# EAGLE design small_weather_station (EAGLE 6.5.0)
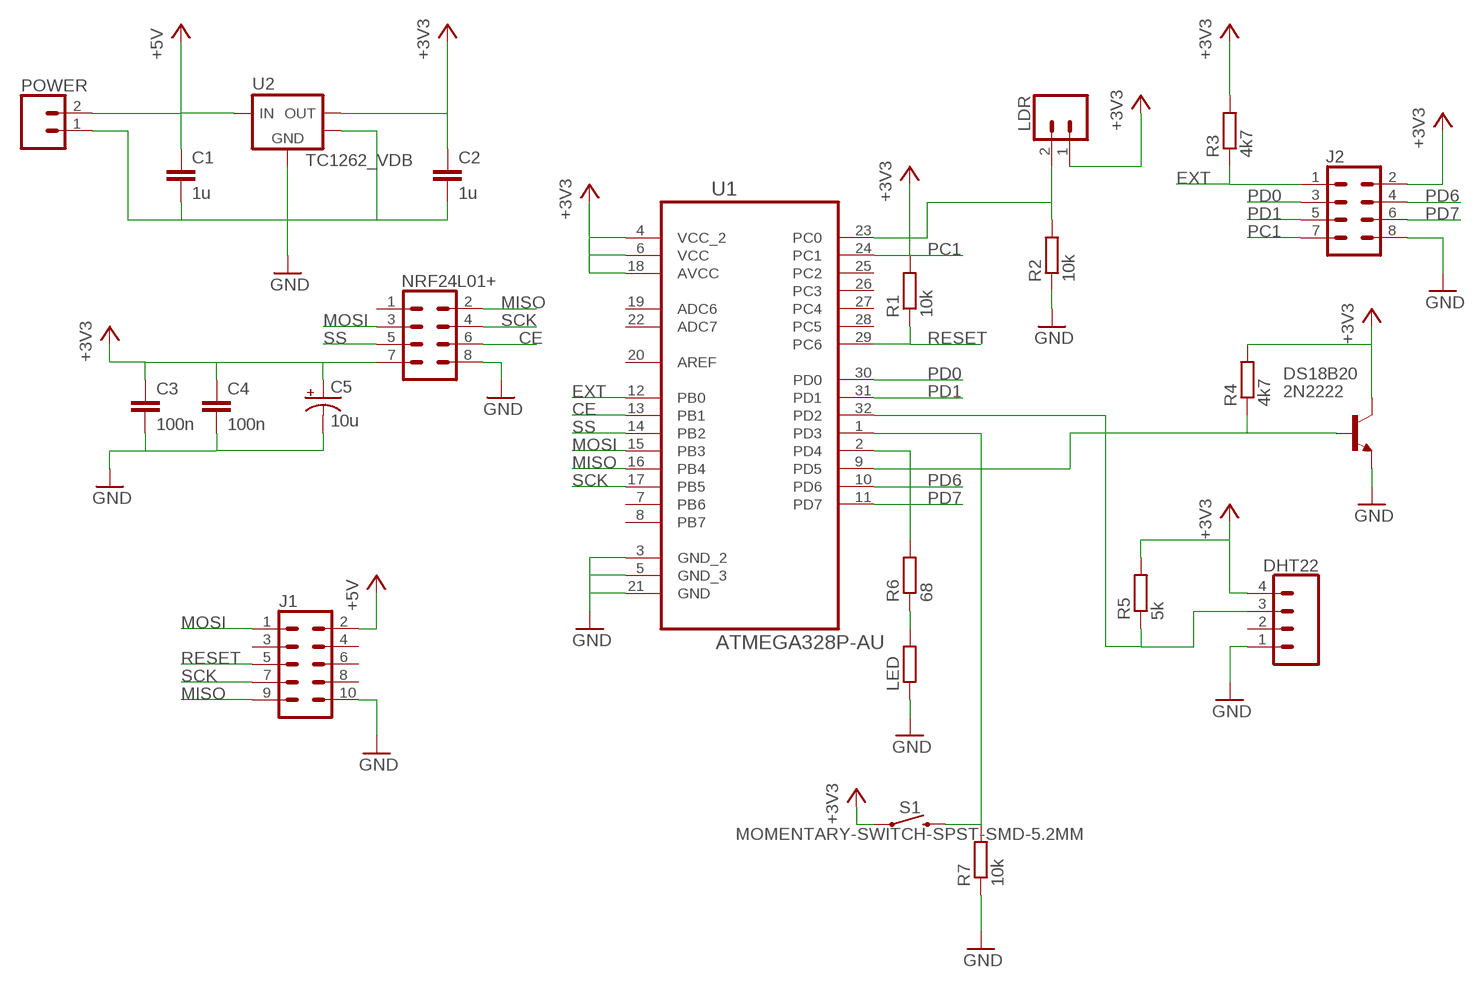
[diagram p0: schematic, sheet 1]

## Parts
C1  1u  C-EUC0402  [C0402]
C2  1u  C-EUC0402  [C0402]
C3  100n  C-EUC0402  [C0402]
C4  100n  C-EUC0402  [C0402]
C5  10u  CPOL-USD  [PANASONIC_D]
DHT22  CONN_04  [1X04]
DS18B20  2N2222  [TO92-EBC-OVAL]
J1  CONN_05X2SHD-NS  [2X5-SHROUDED-NS]
J2  CONN_04X2  [2X4]
LDR  CONN_02  [1X02]
LED  R-EU_R0402  [R0402]
NRF24L01+  CONN_04X2  [2X4]
POWER  CONN_02  [1X02]
R1  10k  R-EU_R0402  [R0402]
R2  10k  R-EU_R0402  [R0402]
R3  4k7  R-EU_R0402  [R0402]
R4  4k7  R-EU_R0402  [R0402]
R5  5k  R-EU_R0402  [R0402]
R6  68  R-EU_R0402  [R0402]
R7  10k  R-EU_R0402  [R0402]
S1  MOMENTARY-SWITCH-SPST-SMD-5.2MM  [TACTILE_SWITCH_SMD_5.2MM]
U1  ATMEGA328P-AU  [QFP80P900X900X120-32N]
U2  TC1262_VDB  [SOT-223-3]

## Nets
+3V3: C2.1 C3.1 C4.1 C5.+ DHT22.4 DS18B20.C J2.2 LDR.1 NRF24L01+.7 R1.2 R3.2 R4.2 R5.2 S1.1 U1.4(VCC_2) U1.6(VCC) U1.18(AVCC) U2.3(VOUT)
+5V: C1.1 J1.2 POWER.2 U2.1(VIN)
CE: NRF24L01+.6 U1.13(PB1)
EXT: J2.1 R3.1 U1.12(PB0)
GND: C1.2 C2.2 C3.2 C4.2 C5.- DHT22.1 DS18B20.E J1.10 J2.8 LED.1 NRF24L01+.8 POWER.1 R2.1 R7.1 U1.3(GND_2) U1.5(GND_3) U1.21(GND) U2.2(GND) U2.4(TAB)
MISO: J1.9 NRF24L01+.2 U1.16(PB4)
MOSI: J1.1 NRF24L01+.3 U1.15(PB3)
N$1: R6.2 U1.2(PD4)
N$6: DHT22.3 R5.1 U1.32(PD2)
N$10: LDR.2 R2.2 U1.23(PC0)
N$12: DS18B20.B R4.1 U1.9(PD5)
N$13: LED.2 R6.1
N$16: R7.2 S1.3 U1.1(PD3)
PC1: J2.7 U1.24(PC1)
PD0: J2.3 U1.30(PD0)
PD1: J2.5 U1.31(PD1)
PD6: J2.4 U1.10(PD6)
PD7: J2.6 U1.11(PD7)
RESET: J1.5 R1.1 U1.29(PC6)
SCK: J1.7 NRF24L01+.4 U1.17(PB5)
SS: NRF24L01+.5 U1.14(PB2)
Unconnected: DHT22.2 J1.3 J1.4 J1.6 J1.8 NRF24L01+.1 U1.7(PB6) U1.8(PB7) U1.19(ADC6) U1.20(AREF) U1.22(ADC7) U1.25(PC2) U1.26(PC3) U1.27(PC4) U1.28(PC5)

## Library data of the parts
C1-C4 = resistor:C-EU: CAPACITOR, European symbol
C5 = adafruit:CPOL-US: POLARIZED CAPACITOR, American symbol
DHT22 = SparkFun-Connectors:CONN_04: Multi connection point. Often used as Generic Header-pin footprint for 0.1 inch spaced/style header connections On any of the 0.1 inch spaced packages, you can populate with these: Break Away Headers - Straight <https://www.sparkfun.com/products/116> (PRT-00116) Break Away Male Headers - Right Angle <https://www.sparkfun.com/products/553> (PRT-00553) Female Headers <https://www.sparkfun.com/products/115> (PRT-00115) Break Away Headers - Machine Pin <https://www.sparkfun.com/products/117> (PRT-00117) Break Away Female Headers - Swiss Machine Pin <https://www.sparkfun.com/products/743> (PRT-00743) For SCREWTERMINALS and SPRING TERMINALS visit here: Screw Terimnals on SparkFun.com <https://www.sparkfun.com/search/results?term=Screw+Terminals> (5mm/3.5mm/2.54mm spacing) This device is also useful as a general connection point to wire up your design to another part of your project. Our various solder wires solder well into these plated through hole pads. Hook-Up Wire - Assortment (Stranded, 22 AWG) <https://www.sparkfun.com/products/11375> (PRT-11375) Hook-Up Wire - Assortment (Solid Core, 22 AWG) <https://www.sparkfun.com/products/11367> (PRT-11367) View the entire wire category on our website here <https://www.sparkfun.com/categories/141> Special notes: Molex polarized connector foot print use with SKU : PRT-08231 with associated crimp pins and housings. 1MM SMD Version SKU: PRT-10208; PROD_ID: CONN-09696
DS18B20 = adafruit:2N2222: NPN TRANSISTOR Big oval pads
J1 = SparkFun-Connectors:CONN_05X2: Multi connection point. Often used as Generic Header-pin footprint for 0.1 inch spaced/style header connections For AVR SPI programming port, see special device with nice symbol: "AVR_SPI_PROG_5x2.dev" You can populate with any combo of single row headers, but if you'd like an exact match, check these: 2x5 AVR ICSP Male Header <https://www.sparkfun.com/products/778> (PRT-00778) 2x5 Pin Shrouded Header <https://www.sparkfun.com/products/8506> (PRT-08506) On any of the 0.1 inch spaced packages, you can populate with these: Break Away Headers - Straight <https://www.sparkfun.com/products/116> (PRT-00116) Break Away Male Headers - Right Angle <https://www.sparkfun.com/products/553> (PRT-00553) Female Headers <https://www.sparkfun.com/products/115> (PRT-00115) Break Away Headers - Machine Pin <https://www.sparkfun.com/products/117> (PRT-00117) Break Away Female Headers - Swiss Machine Pin <https://www.sparkfun.com/products/743> (PRT-00743) Special note: the shrouded connector mates well with our 5x2 ribbon cables: 2x5 Pin IDC Ribbon Cable <https://www.sparkfun.com/products/8535> (PRT-08535); PROD_ID: CONN-08671; SF_ID: PRT-08506
J2 NRF24L01+ = SparkFun-Connectors:CONN_04X2: Multi connection point. Often used as Generic Header-pin footprint for 0.1 inch spaced/style header connections On any of the 0.1 inch spaced packages, you can populate with these: Break Away Headers - Straight <https://www.sparkfun.com/products/116> (PRT-00116) Break Away Male Headers - Right Angle <https://www.sparkfun.com/products/553> (PRT-00553) Female Headers <https://www.sparkfun.com/products/115> (PRT-00115) Break Away Headers - Machine Pin <https://www.sparkfun.com/products/117> (PRT-00117) Break Away Female Headers - Swiss Machine Pin <https://www.sparkfun.com/products/743> (PRT-00743)
LDR POWER = SparkFun-Connectors:CONN_02: Multi connection point. Often used as Generic Header-pin footprint for 0.1 inch spaced/style header connections On any of the 0.1 inch spaced packages, you can populate with these: Break Away Headers - Straight <https://www.sparkfun.com/products/116> (PRT-00116) Break Away Male Headers - Right Angle <https://www.sparkfun.com/products/553> (PRT-00553) Female Headers <https://www.sparkfun.com/products/115> (PRT-00115) Break Away Headers - Machine Pin <https://www.sparkfun.com/products/117> (PRT-00117) Break Away Female Headers - Swiss Machine Pin <https://www.sparkfun.com/products/743> (PRT-00743) For SCREWTERMINALS and SPRING TERMINALS visit here: Screw Terimnals on SparkFun.com <https://www.sparkfun.com/search/results?term=Screw+Terminals> (5mm/3.5mm/2.54mm spacing) This device is also useful as a general connection point to wire up your design to another part of your project. Our various solder wires solder well into these plated through hole pads. Hook-Up Wire - Assortment (Stranded, 22 AWG) <https://www.sparkfun.com/products/11375> (PRT-11375) Hook-Up Wire - Assortment (Solid Core, 22 AWG) <https://www.sparkfun.com/products/11367> (PRT-11367) View the entire wire category on our website here <https://www.sparkfun.com/categories/141> Special notes: Molex polarized connector foot print use with: PRT-08233 with associated crimp pins and housings. 2.54_SCREWTERM for use with PRT-10571. 3.5mm Screw Terminal footprints for PRT-08084 5mm Screw Terminal footprints for use with PRT-08432
LED R1-R7 = resistor:R-EU_: RESISTOR, European symbol
S1 = SparkFun-Switches:MOMENTARY-SWITCH-SPST: Momentary Switch (Pushbutton) - SPST Normally-open (NO) SPST momentary switches (buttons, pushbuttons). Variants PTH-12MM - 12mm square, through-hole Momentary Pushbutton Switch - 12mm Square <https://www.sparkfun.com/products/9190> (COM-09190) PTH-6.0MM, PTH-6.0MM-KIT - 6.0mm square, through-hole Mini Pushbutton Switch <https://www.sparkfun.com/products/97> (COM-00097) KIT package intended for soldering kit's - only one side of pads' copper is exposed. PTH-RIGHT-ANGLE-KIT - Right-angle, through-hole Right Angle Tactile Button <https://www.sparkfun.com/products/10791> - Used on SparkFun BigTime Watch Kit <https://www.sparkfun.com/products/11734> SMD-12MM - 12mm square, surface-mount Tactile Button - SMD (12mm) <https://www.sparkfun.com/products/12993> (COM-12993) Used on SparkFun PicoBoard <https://www.sparkfun.com/products/11888> SMD-4.5MM - 4.5mm Square Trackball Switch Used on SparkFun Blackberry Trackballer Breakout <https://www.sparkfun.com/products/13169> SMD-4.6MMX2.8MM - 4.60mm x 2.80mm, surface mount Used on SparkFun SAMD21 Mini Breakout <https://www.sparkfun.com/products/13664> SMD-5.2MM, SMD-5.2-REDUNDANT - 5.2mm square, surface-mount Mini Pushbutton Switch - SMD <https://www.sparkfun.com/products/8720> (COM-08720) Used on Arduino Pro Mini <https://www.sparkfun.com/products/11114> REDUNDANT package connects both switch circuits together SMD-6.0X3.5MM - 6.0 x 3.5mm, surface mount Momentary Reset Switch SMD <https://www.sparkfun.com/products/8229> (COM-08229) SMD-6.2MM-TALL - 6.2mm square, surface mount Tactile Button - SMD (6mm) <https://www.sparkfun.com/products/12992> Used on SparkFun Digital Sandbox <https://www.sparkfun.com/products/12651> SMD-RIGHT-ANGLE - Right-angle, surface mount Used on SparkFun Block for Intel® Edison - Arduino <https://www.sparkfun.com/products/13036>; PROD_ID: SWCH-08247; SF_SKU: COM-08720
U1 = Atmel_By_element14_Batch_1-00:ATMEGA328P-AU: 8-bit Microcontroller with In-System Programmable Flash; MPN: ATMEGA328P-AU; OC_FARNELL: 1715486; OC_NEWARK: 14R4631; PACKAGE: TQFP-32; SUPPLIER: Atmel
U2 = bt_regulator:TC1262: Microchip TC1262 LDO Regulator The TC1262 is a fixed output, high accuracy (typically ±0.5%) CMOS low dropout regulator. Designed specif- ically for battery-operated systems, the TC1262’s CMOS construction eliminates wasted ground current, significantly extending battery life. Total supply current is typically 80A at full load (20 to 60 times lower than in bipolar regulators). TC1262 key features include ultra low noise operation, very low dropout voltage (typically 350mV at full load), and fast response to step changes in load. Datasheet.pdf <http://ww1.microchip.com/downloads/en/DeviceDoc/21373C.pdf>

## Board
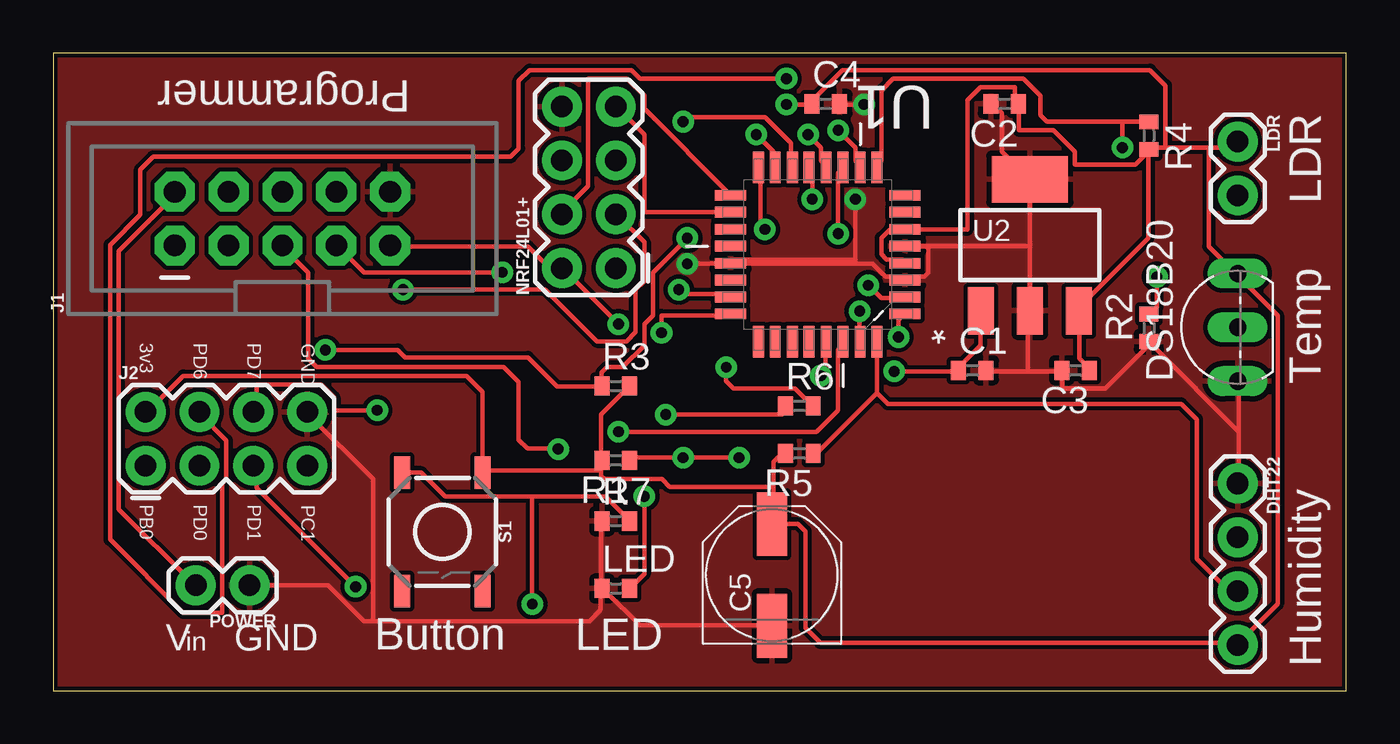
[diagram p1: board, top side]
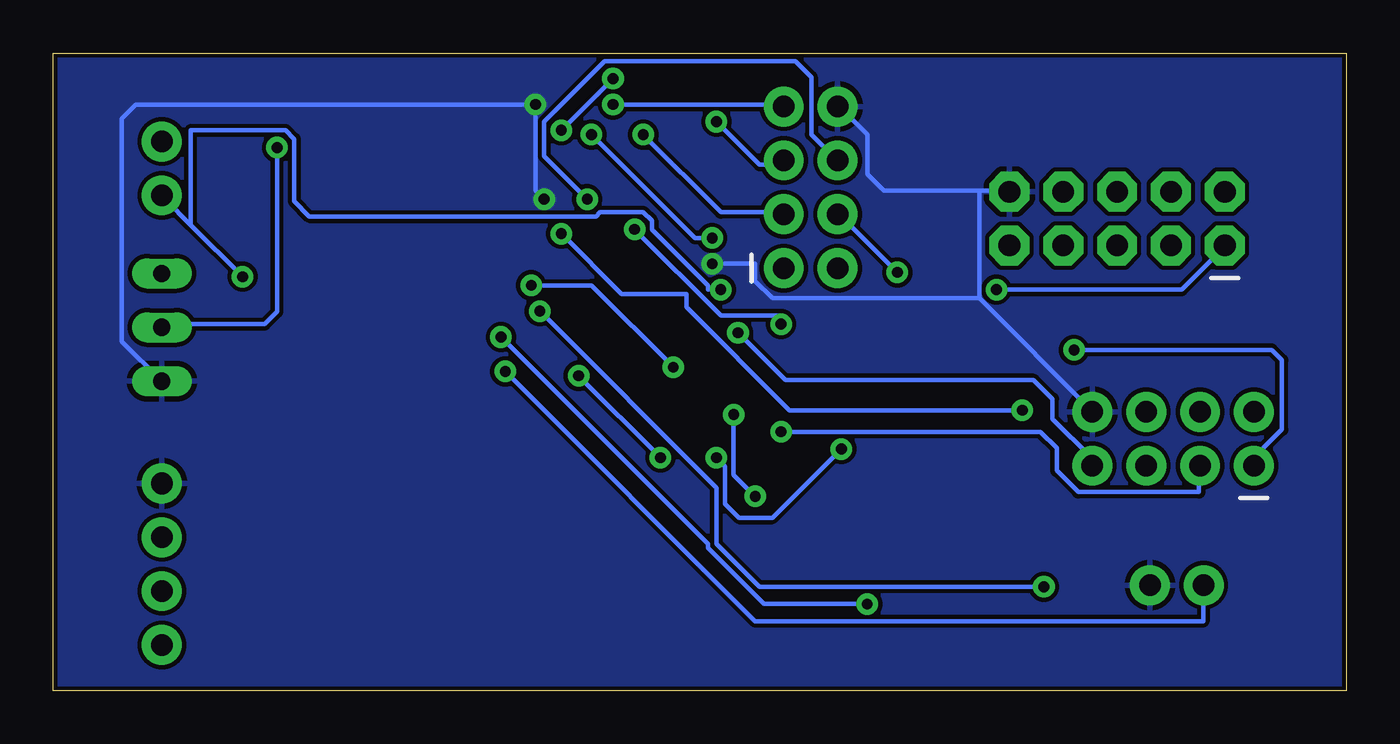
[diagram p2: board, bottom side, seen from below]

Size 61.01 x 30.09 mm. Coordinates in mm from the lower left corner, seen from the top.
Outline: 0,0 61.01,0 61.01,30.09 0,30.09 0,0
Copper layers (1*16): Top 0.035mm / dielectric 1.5mm / Bottom 0.035mm
Design rules "SparkFun": minimum track width 8mil, minimum drill 20mil, track to track 8mil, track to pad 8mil, pad to pad 8mil, via to via 8mil, smd to smd 8mil, copper to edge 8mil, drill to drill 8mil, minimum pad ring 12mil, minimum via ring 10mil, stop-mask expansion 4mil, vias tented up to drill 20mil, thermal gap 10mil

### Footprints (pad centres in the part's own frame; a part is rotated, then mirrored left to right if it is on the bottom)
C0402 = smd 0.7 x 0.9: 1 -0.65,0; 2 0.65,0
PANASONIC_D = smd 3 x 1.4: + 2.4,0; - -2.4,0
1X04 = drill 1.016 pad 1.88: 1 0,0; 2 2.54,0; 3 5.08,0; 4 7.62,0
TO92-EBC-OVAL = drill 0.813 long: B 0,-1.27; C 2.54,-1.27; E -2.54,-1.27
2X5-SHROUDED-NS = drill 1.016 pad 1.88 octagon: 1 -1.27,5.08; 2 1.27,5.08; 3 -1.27,2.54; 4 1.27,2.54; 5 -1.27,0; 6 1.27,0; 7 -1.27,-2.54; 8 1.27,-2.54; 9 -1.27,-5.08; 10 1.27,-5.08
2X4 = drill 1.016 pad 1.88: 1 -3.81,-1.27; 2 -3.81,1.27; 3 -1.27,-1.27; 4 -1.27,1.27; 5 1.27,-1.27; 6 1.27,1.27; 7 3.81,-1.27; 8 3.81,1.27
1X02 = drill 1.016 pad 1.88: 1 0,0; 2 2.54,0
R0402 = smd 0.7 x 0.9: 1 -0.65,0; 2 0.65,0
TACTILE_SWITCH_SMD_5.2MM = smd 1.524 x 0.762: 1 -2.794,1.905; 2 2.794,1.905; 3 -2.794,-1.905; 4 2.794,-1.905
QFP80P900X900X120-32N = smd 1.473 x 0.508: 1 -4.115,2.794; 2 -4.115,2.007; 3 -4.115,1.194; 4 -4.115,0.406; 5 -4.115,-0.406; 6 -4.115,-1.194; 7 -4.115,-2.007; 8 -4.115,-2.794; 17 4.115,-2.794; 18 4.115,-2.007; 19 4.115,-1.194; 20 4.115,-0.406; 21 4.115,0.406; 22 4.115,1.194; 23 4.115,2.007; 24 4.115,2.794 | smd 0.508 x 1.473: 9 -2.794,-4.115; 10 -2.007,-4.115; 11 -1.194,-4.115; 12 -0.406,-4.115; 13 0.406,-4.115; 14 1.194,-4.115; 15 2.007,-4.115; 16 2.794,-4.115; 25 2.794,4.115; 26 2.007,4.115; 27 1.194,4.115; 28 0.406,4.115; 29 -0.406,4.115; 30 -1.194,4.115; 31 -2.007,4.115; 32 -2.794,4.115
SOT-223-3 = smd 1.219 x 2.235: 1 -2.311,-3.099; 2 0,-3.099; 3 2.311,-3.099 | smd 3.6 x 2.2: 4 0,3.099

### Placement (x,y rotation side)
C1  43.36,15.11 0 top
C2  44.88,27.69 180 top
C3  48.23,15.11 180 top
C4  36.45,27.69 0 top
C5  33.91,5.46 90 top
DHT22  55.88,9.78 270 top
DS18B20  54.61,17.15 90 top
J1  10.82,22.28 90 top
J2  8.18,11.89 0 top
LDR  55.88,25.91 270 top
LED  26.54,4.83 0 top
NRF24L01+  25.27,23.75 90 top
POWER  9.27,4.98 180 top
R1  26.54,10.87 180 top
R2  51.69,17.12 90 top
R3  26.54,14.38 0 top
R4  51.69,26.19 270 top
R5  35.2,11.2 180 top
R6  35.2,13.44 0 top
R7  26.54,8 0 top
S1  18.36,7.49 270 top
U1  36.07,20.57 180 top
U2  46.08,21.03 0 top

### Tracks (layer width: path | path; a pad name or v marks a point on that pad's centre or on a via)
+3V3  (via drill 0.51)
  Top 0.203: 33.98,9.65 33.98,7.95 C5.+ | 33.98,9.65 33.98,10.8 34.39,11.2 R5.2 | R3.2 27.08,14.25 25.86,13.03 25.86,11 R1.2 25.86,10.8 25.86,10.39 | 25.86,10.39 20.37,10.39 S1.1 | J2.2 4.52,13.23 6.15,14.86 19.51,14.86 20.27,14.1 S1.1 | 20.17,10.39 S1.1 | U1.4 40.08,20.35 39.32,20.35 39.06,20.6 39.06,21.36 39.47,21.77 U1.6 43.13,21.77 43.13,27.86 43.74,28.47 45.36,28.47 45.36,27.86 C2.1 45.57,27.66 45.57,26.44 47.19,26.44 48.21,25.43 48.21,24.82 51.05,24.82 51.66,25.43 | U1.18 27.89,22.58 27.89,26.24 26.67,27.46 NRF24L01+.7 | 54.51,25.63 55.73,25.63 55.73,25.83 LDR.1 | 54.51,25.63 52.48,25.63 | 52.48,25.63 51.87,25.63 R4.2 51.66,25.43 | 54.51,25.63 54.51,20.96 55.73,19.74 DS18B20.C 55.93,19.53 57.76,17.7 57.76,4.09 55.93,2.26 DHT22.4 55.73,2.26 36.19,2.26 35.48,2.97 35.48,7.52 35.13,7.87 33.92,7.87 C5.+ | v34.59,27.66 35.61,27.66 C4.1 35.81,27.86 37.24,29.29 51.74,29.29 52.48,28.55 52.48,25.63 | 33.98,7.75 C5.+ | 25.86,10.39 25.86,10.14 26.01,9.98 28.73,9.98 29.08,9.63 33.96,9.63 33.98,9.65 | C3.1 48.82,15.27 48.41,15.67 48.41,17.91 U2.3 48.41,18.11 51.66,21.36 51.66,25.43
  Bottom 0.203: v34.59,27.66 26.67,27.66 NRF24L01+.7
+5V  (via drill 0.51)
  Top 0.203: J1.2 5.74,23.39 3.1,20.75 3.1,8.56 6.55,5.11 POWER.2 | U2.1 43.74,17.91 43.74,16.28 42.72,15.27 C1.1 42.52,15.06 v39.67,15.06
  Bottom 0.203: v39.67,15.06 27.89,3.28 6.76,3.28 6.76,4.9 POWER.2
CE  (via drill 0.51)
  Top 0.203: v35.81,23.19 35.81,24.61 U1.13
  Bottom 0.203: v35.81,23.19 37.85,25.22 37.85,26.85 35,29.69 25.98,29.69 25.25,28.96 25.25,26.24 24.03,25.02 NRF24L01+.6
EXT  (via drill 0.51)
  Top 0.203: 25.86,14.45 R3.1 | v35.61,26.24 36.22,25.63 36.22,25.02 36.42,24.82 U1.12 | v29.92,21.36 28.3,19.74 28.3,17.7 27.89,17.3 27.89,16.28 26.87,15.27 26.14,15.27 25.88,15.01 25.88,14.39 R3.1 | 26.06,14.45 R3.1 | v12.85,16.08 16.26,16.08 16.61,15.72 22.4,15.72 23.77,14.35 25.87,14.35 R3.1
  Bottom 0.203: J2.1 4.32,10.8 4.32,11.05 3.05,12.32 3.05,15.6 3.53,16.08 v12.85,16.08 | v35.61,26.24 30.73,21.36 v29.92,21.36
GND  (via drill 0.51)
  Top 0.203: 31.95,20.14 38.66,20.14 39.27,19.53 40.08,19.53 U1.3 | v38.25,27.66 37.24,27.66 C4.2 | 55.73,14.66 DS18B20.E 55.93,14.45 55.93,12.22 | 55.93,12.22 55.93,9.78 DHT22.1 | LED.1 25.86,4.9 25.86,7.95 R7.1 | LED.1 26.06,4.7 27.69,3.07 33.78,3.07 C5.- | 15.09,3.28 14.68,3.28 12.98,4.98 POWER.1 9.4,4.9 | 25.86,4.7 LED.1 | 15.09,3.28 15.09,9.98 12.04,13.03 J2.8 | v29.92,20.14 31.95,20.14 | 31.95,20.14 U1.21 31.95,20.35 37.85,20.35 v37.85,23.19 | 15.09,3.28 25.3,3.28 25.83,3.81 25.83,4.77 LED.1 | U1.3 40.28,19.53 41.1,19.53 41.3,19.74 41.3,20.96 40.28,20.96 U1.5 46.02,20.98 46.1,21.06 | C2.2 44.35,27.66 44.75,27.25 44.75,25.43 45.97,24.21 U2.4 U2.2 45.97,17.91 45.97,15.06 | 40.28,19.33 U1.3 | 55.93,12.22 51.87,16.28 R2.1 51.66,16.28 49.63,14.25 47.6,14.25 47.6,15.06 C3.2 47.4,15.06 45.97,15.06 | 45.97,15.06 44.14,15.06 C1.2
  Bottom 0.203: DS18B20.E 57.76,16.48 57.76,27 57.1,27.66 v38.25,27.66 38.25,23.6 v37.85,23.19 | 17.32,23.6 15.9,23.6 J1.10 | NRF24L01+.8 23.82,27.46 22.61,26.24 22.61,24.38 21.82,23.6 17.32,23.6 | 17.32,18.52 17.32,23.6 | 17.32,18.52 12.04,13.23 J2.8 | v29.92,20.14 27.89,20.14 27.89,19.33 27.08,18.52 17.32,18.52
  pour Top: 0,30.1 61.01,30.1 61.01,0 0,0
  pour Bottom: 0,30.1 61.01,30.1 61.01,0 0,0
MISO  (via drill 0.51)
  Top 0.203: v33.58,21.77 33.38,21.97 33.38,24.61 U1.16 | v26.67,17.3 24.03,19.94 NRF24L01+.2 23.42,19.94 22.4,20.96 15.95,20.96 J1.9 15.9,20.96
  Bottom 0.203: v33.58,21.77 29.52,17.7 26.67,17.7 v26.67,17.3
MOSI  (via drill 0.51)
  Top 0.203: v33.17,26.24 33.98,25.43 33.98,24.82 U1.15 | v16.51,18.92 23.22,18.92 25.65,16.48 27.05,16.48 27.48,16.92 27.48,18.92 27.89,19.33 27.89,21.16 26.67,22.38 NRF24L01+.3
  Bottom 0.203: v33.17,26.24 29.52,22.58 26.67,22.58 NRF24L01+.3 | v16.51,18.92 7.77,18.92 5.74,20.96 J1.1
N$1  (via drill 0.51)
  Top 0.203: v38.46,19.13 39.06,18.52 40.08,18.52 U1.2 | R6.2 35.81,13.44 35,14.25 32.11,14.25 31.75,14.61 v31.75,15.27
  Bottom 0.203: v31.75,15.27 35.61,19.13 v38.46,19.13
N$6
  Top 0.203: 38.86,14.05 36.02,11.2 R5.1 | U1.32 38.86,14.05 | DHT22.3 55.47,4.7 53.95,6.22 53.95,12.8 53.21,13.54 39.37,13.54 38.86,14.05
N$10  (via drill 0.51)
  Top 0.203: v52.07,19.53 52.07,18.11 51.87,17.91 R2.2 | v29.52,18.92 29.52,18.72 31.95,18.72 U1.23
  Bottom 0.203: 54.51,21.97 55.73,23.19 LDR.2 | 54.51,21.97 v52.07,19.53 | v29.52,18.92 30.12,18.92 30.12,19.13 32.77,21.77 32.77,22.17 33.17,22.58 35.2,22.58 35.41,22.38 48.92,22.38 49.63,23.09 49.63,26.04 50.04,26.44 54.51,26.44 54.51,21.97
N$12  (via drill 0.51)
  Top 0.203: 50.44,26.85 51.66,26.85 R4.1 | U1.9 38.86,24.82 39.06,25.02 39.06,28.32 39.62,28.88 45.77,28.88 46.58,28.07 46.58,27.15 46.89,26.85 50.44,26.85 | 50.44,26.85 v50.44,25.63
  Bottom 0.203: DS18B20.B 55.73,17.3 51.03,17.3 50.44,17.88 v50.44,25.63
N$13  (via drill 0.51)
  Top 0.203: v27.89,9.17 27.89,5.51 27.28,4.9 LED.2 | v28.91,13.03 34.39,13.03 34.39,13.44 R6.1
  Bottom 0.203: v27.89,9.17 28.91,10.19 v28.91,13.03
N$16  (via drill 0.51)
  Top 0.203: 22.61,9.17 26.06,9.17 27.08,8.15 R7.2 | 16.51,10.19 S1.3 17.37,10.29 18.49,9.17 22.61,9.17 | v39.88,16.69 39.88,17.5 40.08,17.7 U1.1 | 22.61,9.17 v22.61,4.09
  Bottom 0.203: v39.88,16.69 30.12,6.93 30.12,6.73 27.48,4.09 v22.61,4.09
PC1  (via drill 0.51)
  Top 0.203: v28.7,16.89 28.7,17.7 31.95,17.7 U1.24
  Bottom 0.203: v28.7,16.89 26.47,14.66 14.76,14.66 13.87,13.77 13.87,12.83 12.04,11 12.04,10.8 J2.7
PD0  (via drill 0.51)
  Top 0.203: v26.67,12.22 36.02,12.22 37.03,13.23 37.03,16.08 37.24,16.28 U1.30
  Bottom 0.203: J2.3 6.96,10.59 6.96,9.37 12.65,9.37 13.66,10.39 13.66,11.46 14.43,12.22 v26.67,12.22
PD1  (via drill 0.51)
  Top 0.203: v38.05,17.91 38.05,16.48 U1.31 | v14.27,4.9 9.6,9.58 9.6,10.59 J2.5
  Bottom 0.203: v38.05,17.91 29.72,9.58 29.72,6.93 27.69,4.9 v14.27,4.9
PD6  (via drill 0.51)
  Top 0.203: v37.03,26.44 37.85,25.63 37.85,25.02 38.05,24.82 U1.10 | v34.59,28.88 27.69,28.88 27.28,29.29 22.48,29.29 21.97,28.78 21.97,25.58 21.59,25.2 4.72,25.2 4.11,24.59 4.11,22.45 2.69,21.03 2.69,7.14 6.15,3.68 7.98,3.68 7.98,9.78 8.18,9.98 8.18,11.81 6.96,13.03 J2.4
  Bottom 0.203: v34.59,28.88 v37.03,26.44
PD7  (via drill 0.51)
  Top 0.203: v37.03,21.57 37.03,24.41 37.24,24.61 U1.11 | v15.29,13.23 13.26,13.23 13.26,13.84 12.65,14.45 9.6,14.45 9.6,13.23 J2.6
  Bottom 0.203: v37.03,21.57 34.19,18.72 31.14,18.72 31.14,18.11 26.26,13.23 v15.29,13.23
RESET  (via drill 0.51)
  Top 0.203: v32.36,11 v29.72,11 27.28,11 R1.1 | v36.22,14.86 36.42,15.06 36.42,16.28 U1.29 | J1.5 10.82,20.96 12.04,19.74 12.04,15.67 12.45,15.27 21.26,15.27 21.97,14.55 21.97,11.84 22.38,11.43 23.8,11.43 v23.82,11.41
  Bottom 0.203: v36.22,14.86 v32.36,11 | v23.82,11.41 27.08,8.15 28.65,8.15 29.31,8.81 29.31,10.59 v29.72,11
SCK  (via drill 0.51)
  Top 0.203: U1.17 31.95,23.39 27.89,27.46 27.89,28.07 27.08,28.88 25.25,28.88 25.25,23.8 24.03,22.58 NRF24L01+.4 | v21.18,19.74 14.68,19.74 13.46,20.96 J1.7
  Bottom 0.203: v21.18,19.74 23.82,22.38 NRF24L01+.4
SS  (via drill 0.51)
  Top 0.203: v29.72,26.85 29.72,27.05 33.58,27.05 34.8,25.83 34.8,24.82 U1.14
  Bottom 0.203: v29.72,26.85 27.69,24.82 26.67,24.82 26.67,25.02 NRF24L01+.5

### Text on the board
tPlace: Programmer | LDR | 3v3 | PD6 | PD7 | GND | Temp | PB0 | PD0 | PD1 | PC1 | V | in | GND | Button | LED | Humidity